# Altium schematic sheet LCD-Memory.SchDoc
size B; DocumentNumber: 5; SheetNumber: 5; SheetTotal: 7; ENG_APP_DATE: --/--/--; DSN_APP_DATE: --/--/--; CHK_APP_DATE: --/--/--
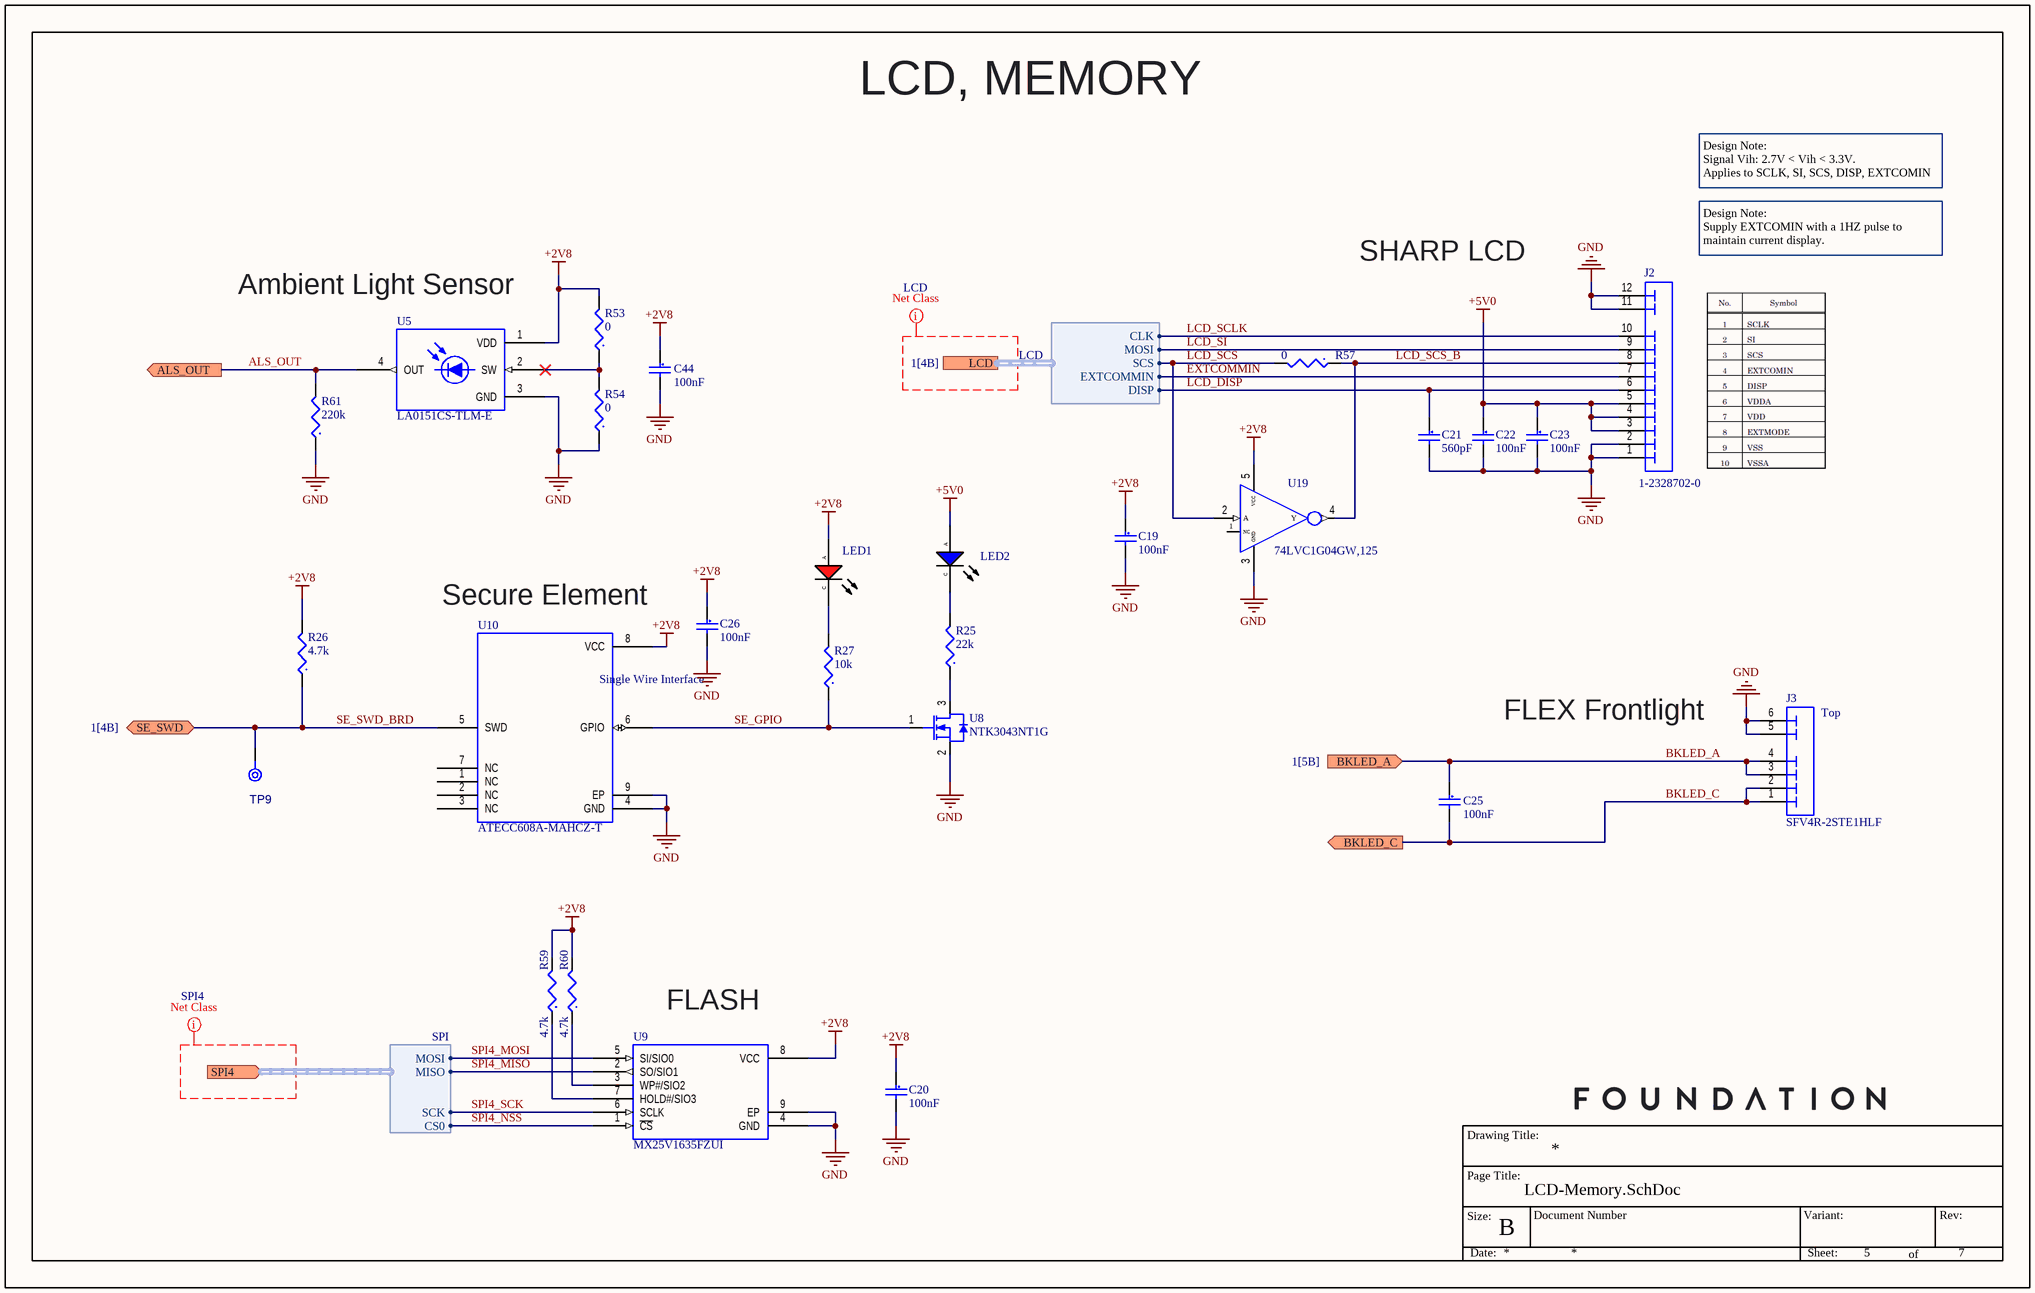
[diagram p0: LCD-Memory.SchDoc]

## Parts
C19  Capacitance: 100nF  [CAPC0402(1005)55_L]  (hidden comment: CAP CER 0.1uF 16V 10% X7R 0402)
C20  Capacitance: 100nF  [CAPC0402(1005)55_L]  (hidden comment: CAP CER 0.1uF 16V 10% X7R 0402)
C21  Capacitance: 560pF  [CAPC0402(1005)55_L]  (hidden comment: CAP CER 560pF 50V 10% X7R 0402)
C22  Capacitance: 100nF  [CAPC0402(1005)55_L]  (hidden comment: CAP CER 0.1uF 16V 10% X7R 0402)
C23  Capacitance: 100nF  [CAPC0402(1005)55_L]  (hidden comment: CAP CER 0.1uF 16V 10% X7R 0402)
C25  Capacitance: 100nF  [CAPC0402(1005)55_L]  (hidden comment: CAP CER 0.1uF 16V 10% X7R 0402)
C26  Capacitance: 100nF  [CAPC0402(1005)55_L]  (hidden comment: CAP CER 0.1uF 16V 10% X7R 0402)
C44  Capacitance: 100nF  [CAPC0402(1005)55_L]  (hidden comment: CAP CER 0.1uF 16V 10% X7R 0402)
J2  1-2328702-0  [TE - 1-2328702-0_V]
J3  SFV4R-2STE1HLF  Contact Location: Top  [AMPH - SFV4R-2STBE1HLF]
LED1  LTST-C191KRKT  [LEDC0603(1608)65_L]  (value not drawn)
LED2  KB DELPS2.DI-THVG-2J8L-Z555  [LEDC0603(1608)65_L]  (value not drawn)
R25  Resistance: 22k  [RESC0402(1005)_L]  (hidden comment: RES 22K 1/16W 1% 0402)
R26  Resistance: 4.7k  [RESC0402(1005)_L]  (hidden comment: RES 4.7K 1/16W 1% 0402)
R27  Resistance: 10k  [RESC0402(1005)_L]  (hidden comment: RES 10K 1/16W 1% 0402)
R53  Resistance: 0  [RESC0402(1005)_L]  (hidden comment: RES 0 OHM JUMPER 1/16W 0402)
R54  Resistance: 0  [RESC0402(1005)_L]  (hidden comment: RES 0 OHM JUMPER 1/16W 0402)
R57  Resistance: 0  [RESC0402(1005)_L]  (hidden comment: RES 0 OHM JUMPER 1/16W 0402)
R59  Resistance: 4.7k  [RESC0402(1005)_L]  (hidden comment: RES 4.7K 1/16W 1% 0402)
R60  Resistance: 4.7k  [RESC0402(1005)_L]  (hidden comment: RES 4.7K 1/16W 1% 0402)
R61  Resistance: 220k  [RESC0402(1005)_L]  (hidden comment: RES 220K 1/16W 1% 0402)
TP9  TPAD8R  [TP08R]  (value not drawn)  (no BOM)
U5  LA0151CS-TLM-E  [ON - ODCSP-4_V]
U8  NTK3043NT1G  [SOT-723-3(40)_N]
U9  MX25V1635FZUI  [MXIC - USON-8_V]
U10  ATECC608A-MAHCZ-T  [MCHP - UDFN-8_L]
U19  74LVC1G04GW,125  [NEXP - TSSOP-5_L]

## Ports
ALS_OUT (out), BKLED_A (in, see 1[5B]), BKLED_C (out), LCD (harness LCD, see 1[4B]), SE_SWD (bidir, see 1[4B]), SPI4 (in, harness SPI)

## Harnesses
LCD: CLK, SCS, MOSI, DISP, EXTCOMMIN
SPI: CS0, MISO, MOSI, SCK

## Nets
+2V8: C19.1 C20.1 C26.1 C44.1 LED1.A R26.2 R53.2 R59.2 R60.2 U5.1(VDD) U9.8(VCC) U10.8(VCC) U19.5(VCC)
+5V0: C22.1 C23.1 J2.3 J2.4 J2.5 LED2.A
GND: C19.2 C20.2 C21.2 C22.2 C23.2 C26.2 C44.2 J2.1 J2.2 J2.11 J2.12 J3.5 J3.6 R54.1 R61.1 U5.3(GND) U8.2(S) U9.4(GND) U9.9(EP) U10.4(GND) U10.9(EP) U19.3(GND)
ALS_OUT: R61.2 U5.4(OUT) ; port ALS_OUT
BKLED_A: C25.1 J3.3 J3.4 ; port BKLED_A
BKLED_C: C25.2 J3.1 J3.2 ; port BKLED_C
EXTCOMMIN: J2.7 ; port LCD.EXTCOMMIN
LCD_DISP: C21.1 J2.6 ; port LCD.DISP
LCD_SCLK: J2.10 ; port LCD.CLK
LCD_SCS: R57.2 U19.2(A) ; port LCD.SCS
LCD_SCS_B: J2.8 R57.1 U19.4(Y)
LCD_SI: J2.9 ; port LCD.MOSI
SE_GPIO: R27.1 U8.1(G) U10.6(GPIO)
SE_SWD_BRD: R26.1 TP9.1(TP) U10.5(SWD) ; port SE_SWD
SPI4_MISO: U9.2(SO/SIO1) ; port SPI4.MISO
SPI4_MOSI: U9.5(SI/SIO0) ; port SPI4.MOSI
SPI4_NSS: U9.1(~{CS}) ; port SPI4.CS0
SPI4_SCK: U9.6(SCLK) ; port SPI4.SCK
NetLED1_C: LED1.C R27.2
NetLED2_C: LED2.C R25.2
NetR25_1: R25.1 U8.3(D)
NetR53_1: R53.1 R54.2 U5.2(SW)
NetR59_1: R59.1 U9.7(HOLD#/SIO3)
NetR60_1: R60.1 U9.3(WP#/SIO2)

Not connected (* = marked no-connect by the designer): U10 1(NC) 2(NC) 3(NC) 7(NC); U19 1(NC)

## Layout directives
net class LCD: (no net found under the mark)
net class SPI4: (no net found under the mark)

## Notes on the sheet
- LCD, MEMORY
- Design Note:
  Signal Vih: 2.7V < Vih < 3.3V.
  Applies to SCLK, SI, SCS, DISP, EXTCOMIN
- (near U5) Ambient Light Sensor
- SHARP LCD
- Design Note:
  Supply EXTCOMIN with a 1HZ pulse to maintain current display.
- (near U10) Secure Element
- FLEX Frontlight
- (near U9) FLASH
- Drawing Title:
- Page Title:
- Size:
- B
- Document Number
- Variant:
- Rev:
- Date:
- Sheet:
- of
- (in symbol CMP-IC-MEM-0002-6) Single Wire Interface

## Library data of the parts
C19 C20 C22 C23 C25 C26 C44 = CMP-CAP-00002-2: 0.1µF ±10% 16V Ceramic Capacitor X7R 0402 (1005 Metric); Insulation Resistance: 10GR; Material: Ceramic; Tolerance: 10%; REACH SVHC: No SVHC; Radiation Hardening: No; Case Code (Metric): 1005; Height: 0.5mm; Depth: 0.5mm; Min Operating Temperature: -55°C; Max Operating Temperature: 125°C; Lead Free: Lead Free; Thickness: 0.022inch; Length: 1mm; Voltage Rating (DC): 16V; Dielectric Material: Ceramic; Packaging: Tape and Reel; Case/Package: 0402; Width: 0.5mm; Termination: SMD/SMT; Voltage Rating: 16V; Mount: Surface Mount; Case Code (Imperial): 0402; Package Quantity: 1; Dielectric: X7R; Number of Pins: 2; Voltage: 16V
C21 = CMP-CAP-00005-1: 560pF ±10% 50V Ceramic Capacitor X7R 0402 (1005 Metric); Case/Package: 0402; Material: Ceramic; Thickness: 0.022inch; Tolerance: 10%; Min Operating Temperature: -55°C; Lead Free: Lead Free; Radiation Hardening: No; Dielectric: X7R; Voltage Rating (DC): 50V; Max Operating Temperature: 125°C; Depth: 0.5mm; Termination: SMD/SMT; Width: 0.5mm; Voltage: 50V; Voltage Rating: 50V; Case Code (Imperial): 0402; Packaging: Tape and Reel; Case Code (Metric): 1005; Mount: Surface Mount; Height: 0.5mm; Length: 1mm; Package Quantity: 1
J2 = CMP-CON-0035-1: 10 Position FPC Connector Contacts, Top and Bottom 0.020" (0.50mm) Surface Mount, Right Angle; Min Operating Temperature: -55°C; ComponentLink1Description: Datasheet; Max Operating Temperature: 85°C; ComponentLink1URL: https://www.te.com/commerce/DocumentDelivery/DDEController?Action=srchrtrv&DocNm=2328702&DocType=Customer+Drawing&DocLang=English
J3 = CMP-CON-0036-3: 4 Position FFC, FPC Connector Contacts, Top 0.020" (0.50mm) Surface Mount, Right Angle; Actuator Material: Glass,Polyphenylene; Insulation Resistance: 100MR; Number of Positions: 4; Wire/Cable Type: Straight; Pitch: 0.5mm; Voltage Rating: 50V; Current Rating: 500mA; Contact Resistance: 30mR; Number of Rows: 1; Contact Plating: Tin; Max Operating Temperature: 105°C; Termination: Solder; Orientation: Right Angle; Contact Material: Bronze; Housing Material: Polyamide; Packaging: Tape and Reel; Flammability Rating: UL94 V-0; Mount: Surface Mount; Package Quantity: 3000; Min Operating Temperature: -55°C; Max Voltage Rating (AC): 50V; Number of Contacts: 4; Depth: 4.9mm; Max Voltage Rating (DC): 50V; Radiation Hardening: No; Lead Free: Lead Free; Length: 7.5mm; Housing Color: Black
LED1 = CMP-007-00039-8: Red 631nm LED Indication - Discrete 2V 0603 (1608 Metric); Viewing Angle: 130°; Test Current: 20mA; Number of LEDs: 1; Reverse Voltage: 5V; Power Rating: 75mW; Luminous Intensity: 54mcd; Lens Color: Colorless; Lens Style: Clear,Diffused,Colorless,Rectangular; Lens Transparency: Clear; Wavelength: 639nm; Forward Current: 30mA; Case/Package: 0603; Lead Free: Lead Free; Dominant Wavelength: 631nm; Forward Voltage: 2V; Depth: 0.8mm; Length: 1.6mm; Height: 0.55mm; Power Dissipation: 75mW; Voltage: 2V; Width: 0.8mm; Mount: Surface Mount; Illumination Color: Red; Case Code (Metric): 1608; Case Code (Imperial): 0603; Number of Pins: 2; Packaging: Tape and Reel; Max Operating Temperature: 85°C; Min Operating Temperature: -55°C; Radiation Hardening: No; Color: Red; Package Quantity: 1; Number of Elements: 1
LED2 = CMP-007-00045-4: Blue 466nm LED Indication - Discrete 2.8V 2-SMD 0603
R25 = CMP-RES-00040-1: 22 kOhms ±1% 0.063W, 1/16W Chip Resistor 0402 (1005 Metric); Voltage Rating: 50V; Max Power Dissipation: 63mW; Temperature Coefficient: 100ppm/°C; Max Operating Temperature: 155°C; Case/Package: 0402; Min Operating Temperature: -55°C; Tolerance: 1%; Depth: 0.5mm; Composition: Thick Film; Number of Terminations: 2; Features: Automotive AEC-Q200; Power Rating: 63mW; Radiation Hardening: No; Voltage Rating (DC): 50V; Termination: SMD/SMT; Lead Free: Lead Free; Width: 0.5mm; Contact Plating: Tin; Weight: 2.3E-05oz; Length: 1mm; Packaging: Tape and Reel; REACH SVHC: Unknown; Package Quantity: 10; Mount: Surface Mount; Working Voltage: 50V; Case Code (Metric): 1005; Military Standard: Not; Height: 0.35mm; Case Code (Imperial): 0402
R26 R59 R60 = CMP-RES-00002-3: 4.7 kOhms ±1% 0.063W, 1/16W Chip Resistor 0402 (1005 Metric) Automotive AEC-Q200 Thick Film; Max Power Dissipation: 63mW; Voltage Rating (DC): 50V; Temperature Coefficient: 100ppm/°C; Weight: 2.3E-05oz; Package Quantity: 10; Military Standard: Not; Contact Plating: Tin; Termination: SMD/SMT; Max Operating Temperature: 155°C; Case Code (Metric): 1005; Case Code (Imperial): 0402; Features: Automotive AEC-Q200; Power Rating: 63mW; REACH SVHC: Unknown; Min Operating Temperature: -55°C; Tolerance: 1%; Mount: Surface Mount; Width: 0.5mm; Depth: 0.5mm; Radiation Hardening: No; Length: 1mm; Number of Terminations: 2; Case/Package: 0402; Voltage Rating: 50V; Height: 0.35mm; Packaging: Tape and Reel; Lead Free: Lead Free; Composition: Thick Film
R27 = CMP-RES-00006-3: 10 kOhms ±1% 0.063W, 1/16W Chip Resistor 0402 (1005 Metric); Max Power Dissipation: 63mW; Temperature Coefficient: 100ppm/°C; Voltage Rating: 50V; Termination: SMD/SMT; Max Operating Temperature: 155°C; Height: 0.35mm; Length: 1mm; Case Code (Metric): 1005; REACH SVHC: Unknown; Case/Package: 0402; Number of Terminations: 2; Weight: 2.3E-05oz; Composition: Thick Film; Contact Plating: Tin; Min Operating Temperature: -55°C; Width: 0.02inch; Package Quantity: 10; Military Standard: Not; Case Code (Imperial): 0402; Depth: 0.5mm; Features: Automotive AEC-Q200; Packaging: Tape and Reel; Radiation Hardening: No; Lead Free: Lead Free; Power Rating: 63mW; Tolerance: 1%; Voltage Rating (DC): 50V; Number of Pins: 2; Mount: Surface Mount
R53 R54 R57 = CMP-RES-00014-4: 0 Ohms Jumper 0.063W, 1/16W Chip Resistor 0402 (1005 Metric); Temperature Coefficient: 200ppm/°C; Power Rating: 62.5mW; Max Power Dissipation: 63mW; Tolerance: 5%; Voltage Rating: 50V; Lead Free: Lead Free; Height: 0.016inch; Military Standard: Not; Max Operating Temperature: 155°C; Features: Moisture Resistant; Case/Package: 0402; Contact Plating: Tin,Matte; Composition: Thick Film; Number of Terminations: 2; Case Code (Imperial): 0402; Package Quantity: 1; REACH SVHC: Unknown; Radiation Hardening: No; Case Code (Metric): 1005; Width: 0.02inch; Termination: SMD/SMT; Min Operating Temperature: -55°C; Length: 1mm; Packaging: Tape and Reel; Depth: 0.5mm
R61 = CMP-RES-00039-1: 220 kOhms ±1% 0.063W, 1/16W Chip Resistor 0402 (1005 Metric); Power Rating: 63mW; Voltage Rating (DC): 50V; Temperature Coefficient: 100ppm/°C; Military Standard: Not; Case Code (Metric): 1005; Case Code (Imperial): 0402; Min Operating Temperature: -55°C; Length: 1mm; Weight: 2.3E-05oz; Width: 0.5mm; Number of Terminations: 2; Radiation Hardening: No; REACH SVHC: Unknown; Tolerance: 1%; Package Quantity: 10; Lead Free: Lead Free; Max Power Dissipation: 63mW; Features: Automotive AEC-Q200; Height: 0.35mm; Composition: Thick Film; Max Operating Temperature: 155°C; Contact Plating: Tin; Depth: 0.5mm; Voltage Rating: 50V; Packaging: Tape and Reel; Case/Package: 0402; Termination: SMD/SMT; Mount: Surface Mount
TP9 = CMP-MECH-00011-2: 0.8mm round; Pins: 1
U5 = CMP-SEN-0006-2: Optical Sensor Ambient 550nm Current 4-WFBGA, CSPBGA; Max Input Voltage: 5.5V; Min Input Voltage: 2.2V; Min Operating Temperature: -30°C; ComponentLink1URL: https://www.onsemi.com/pub/Collateral/LA0151CS-D.PDF; Lead Free: Lead Free; Sensing Method: Optical; Package Quantity: 5000; Height: 0.5mm; Max Operating Temperature: 85°C; Wavelength: 550nm; Number of Pins: 4; Width: 1.01mm; Max Supply Voltage: 5.5V; Packaging: Tape and Reel; Case/Package: SMD/SMT; Min Supply Voltage: 2.2V; Length: 1.01mm; ComponentLink1Description: Datasheet
U8 = CMP-TRNST-0003-1: N-Channel 20V 210mA (Ta) 310mW (Ta) Surface Mount SOT-723; Power Dissipation: 440mW; Gate to Source Voltage (Vgs): 10V; Drain to Source Resistance: 3.4R; Input Capacitance: 11pF; Turn-On Delay Time: 13ns; Vgs(th) (Max) @ Id: 1.3V @ 250µA; Turn-Off Delay Time: 94ns; Rise Time: 15ns; Number of Elements: 1; Element Configuration: Single; Current Rating: 225mA; Threshold Voltage: 400mV; Max Operating Temperature: 150°C; Package Quantity: 1; Packaging: Tape and Reel; Continuous Drain Current (ID): 210mA; Pins: 3; Min Operating Temperature: -55°C; Vgs (Max): 10V; Drain to Source Breakdown Voltage: 20V; Radiation Hardening: No; Mounting Technology: Surface Mount; Drain to Source Voltage (Vdss): 20V; Number of Pins: 3; Max Power Dissipation: 310mW; Fall Time: 15ns; Case/Package: SOT-723-3; Transistor Type: N-Channel; Rds On Max: 3.4R; Lead Free: Lead Free; Height: 0.55mm; Contact Plating: Tin,Matte; On-State Resistance: 3.4R; Length: 1.25mm; REACH SVHC: No SVHC; Width: 0.85mm; Voltage Rating (DC): 20V
U9 = CMP-IC-MEM-0015-3: FLASH - NOR Memory IC 16Mb (2M x 8) SPI - Quad I/O 80MHz  8-USON (2x3); ComponentLink1URL: https://www.macronix.com/Lists/Datasheet/Attachments/7409/MX25V1635F,%202.5V,%2016Mb,%20v1.4.pdf; ComponentLink1Description: Datasheet
U10 = CMP-IC-MEM-0002-6: Cryptographic Co-Processor with Secure Hardware-Based Key Storage 1-Wire Interface 8-Pin UDFN T/R; Case/Package: 8-UDFN (2x3)
U19 = CMP-IC-LOG-0005-2: Inverter IC 1 Channel  5-TSSOP; Min Supply Voltage: 1.65V; Max Supply Voltage: 5.5V; Output Function: Y=~A; Max Operating Temperature: 125°C; ComponentLink1Description: Datasheet; RoHS Compliant: ROHS3 Compliant; Min Operating Temperature: -40°C; Pins: 1; ComponentLink1URL: https://assets.nexperia.com/documents/data-sheet/74LVC1G04.pdf; Case/Package: 5-TSSOP; Logic Type: Inverter